# Altium schematic sheet Connectors.SchDoc: HR20E
size A3; Organization: Highlander Racing; Address1: UC Riverside
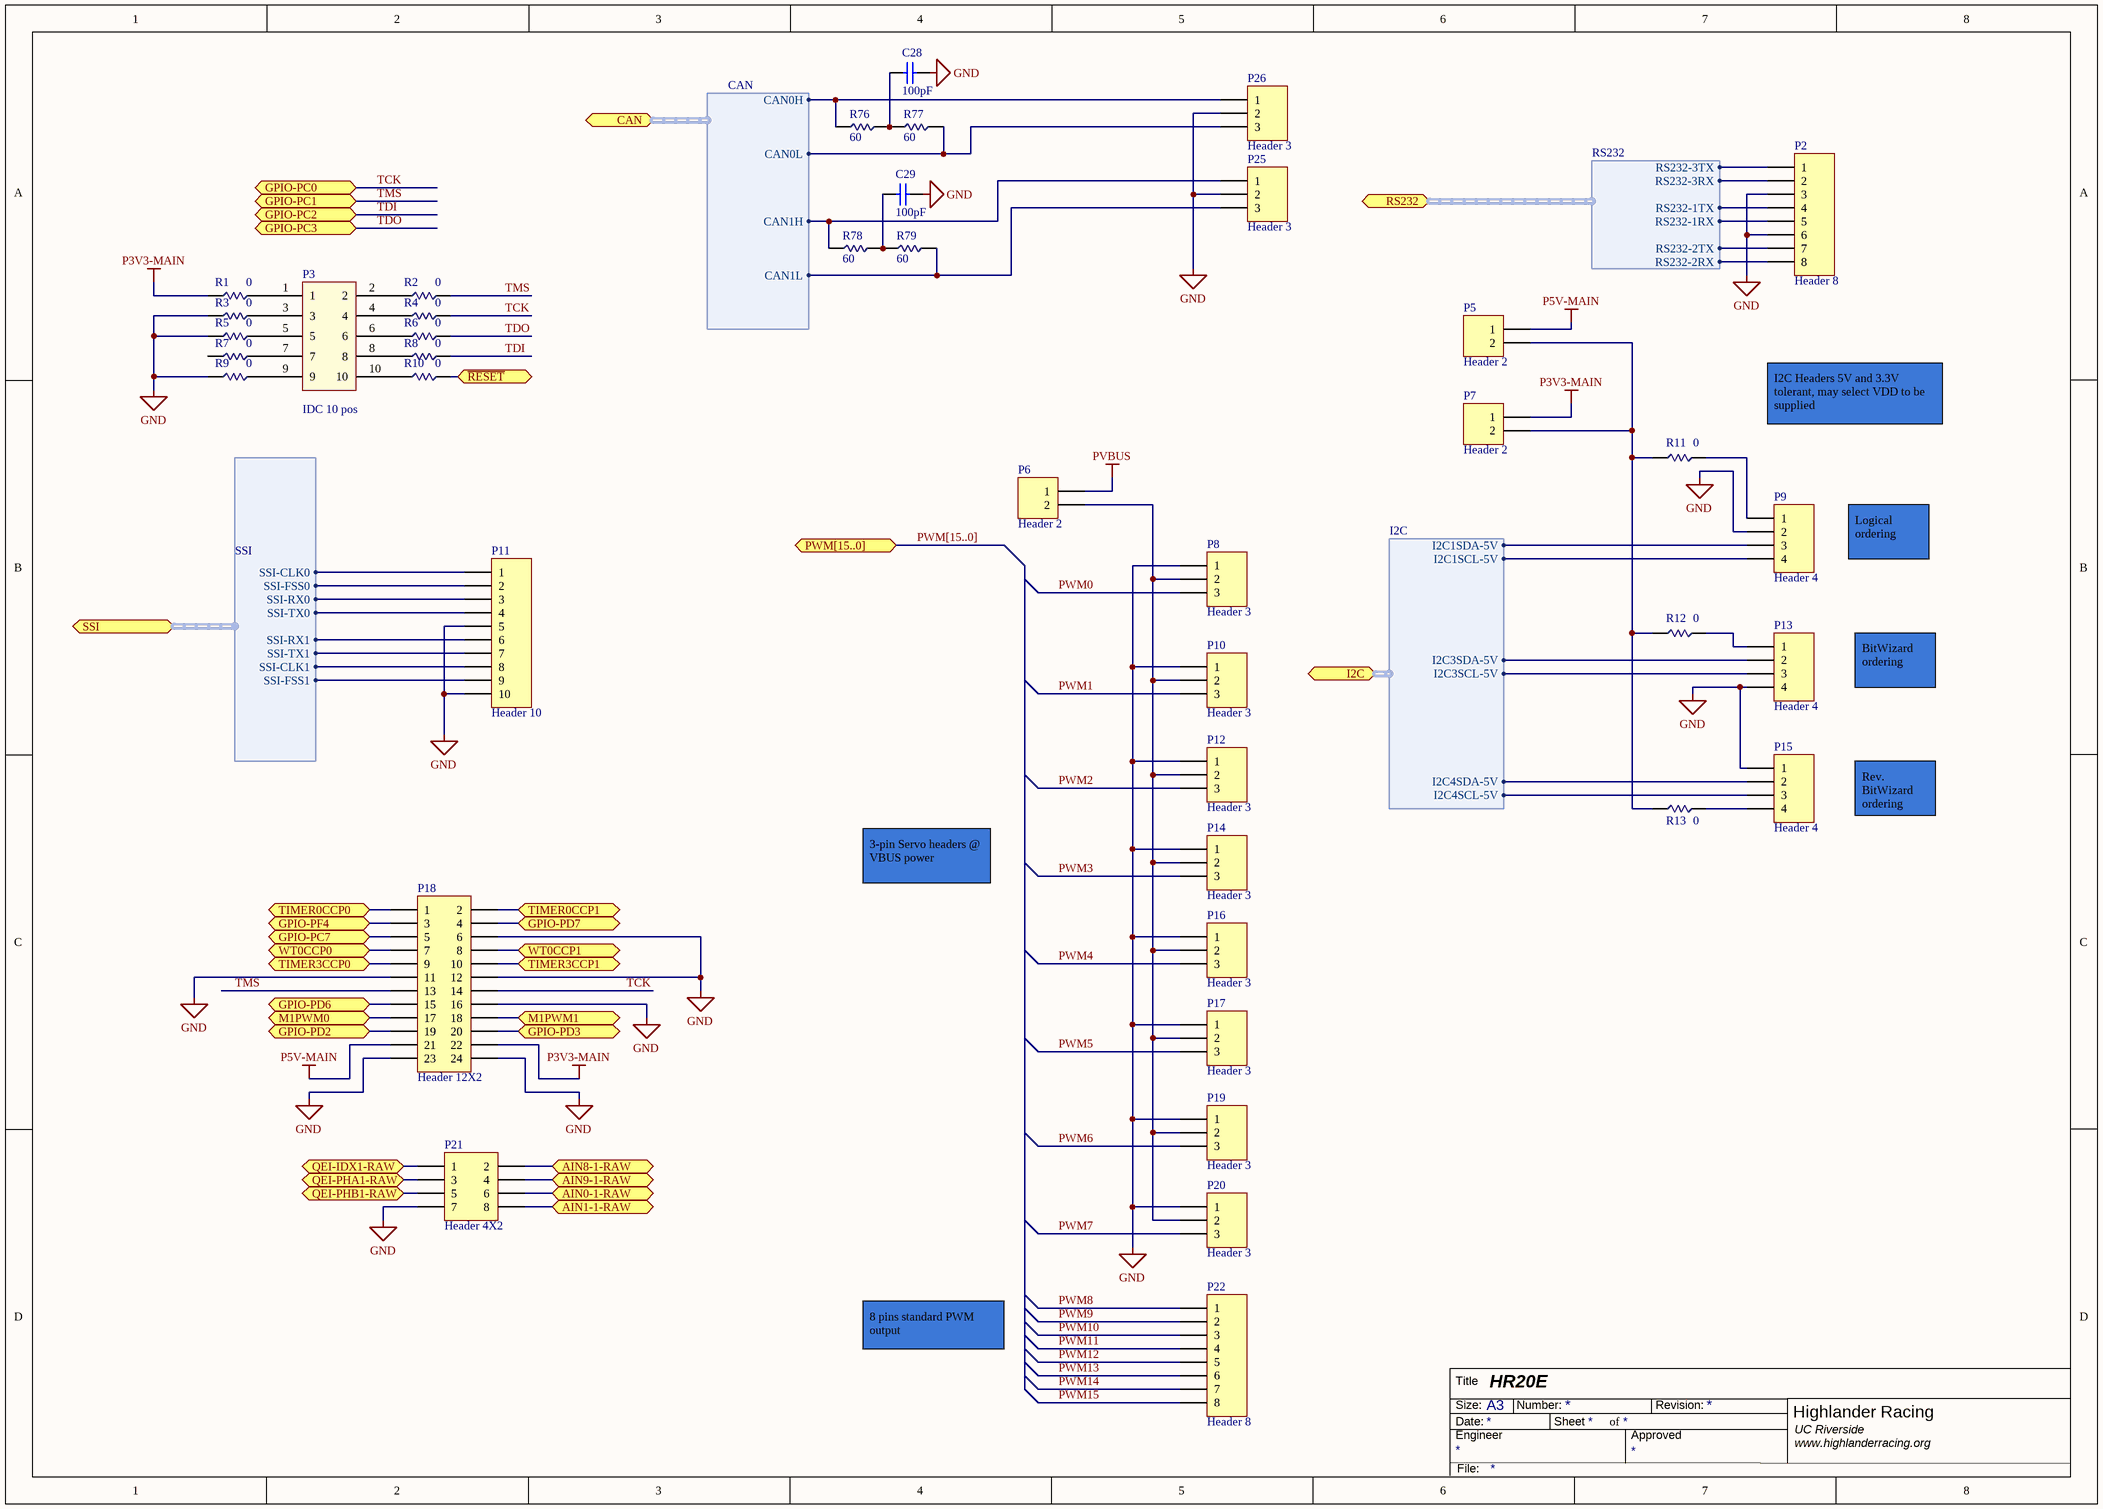
[diagram p0: Connectors.SchDoc]

## Parts
C28  value 100pF  [FOOTPRINT-0805-GEN]  (hidden comment: Capacitor-Generic-0805)
C29  value 100pF  [FOOTPRINT-0805-GEN]  (hidden comment: Capacitor-Generic-0805)
P2  Header 8  [HDR1X8]
P3  IDC 10 pos  [FOOTPRINT-GENERIC-10-HEADER-0MM5]
P5  Header 2  [HDR1X2]
P6  Header 2  [HDR1X2]
P7  Header 2  [HDR1X2]
P8  Header 3  [HDR1X3]
P9  Header 4  [HDR1X4]
P10  Header 3  [HDR1X3]
P11  Header 10  [HDR1X10]
P12  Header 3  [HDR1X3]
P13  Header 4  [HDR1X4]
P14  Header 3  [HDR1X3]
P15  Header 4  [HDR1X4]
P16  Header 3  [HDR1X3]
P17  Header 3  [HDR1X3]
P18  Header 12X2  [HDR2X12]
P19  Header 3  [HDR1X3]
P20  Header 3  [HDR1X3]
P21  Header 4X2  [HDR2X4]
P22  Header 8  [HDR1X8]
P25  Header 3  [HDR1X3]
P26  Header 3  [HDR1X3]
R1  value 0  [FOOTPRINT-0805-GEN]  (hidden comment: SMC)
R2  value 0  [FOOTPRINT-0805-GEN]  (hidden comment: SMC)
R3  value 0  [FOOTPRINT-0805-GEN]  (hidden comment: SMC)
R4  value 0  [FOOTPRINT-0805-GEN]  (hidden comment: SMC)
R5  value 0  [FOOTPRINT-0805-GEN]  (hidden comment: SMC)
R6  value 0  [FOOTPRINT-0805-GEN]  (hidden comment: SMC)
R7  value 0  [FOOTPRINT-0805-GEN]  (hidden comment: SMC)
R8  value 0  [FOOTPRINT-0805-GEN]  (hidden comment: SMC)
R9  value 0  [FOOTPRINT-0805-GEN]  (hidden comment: SMC)
R10  value 0  [FOOTPRINT-0805-GEN]  (hidden comment: SMC)
R11  value 0  [FOOTPRINT-0805-GEN]  (hidden comment: SMC)
R12  value 0  [FOOTPRINT-0805-GEN]  (hidden comment: SMC)
R13  value 0  [FOOTPRINT-0805-GEN]  (hidden comment: SMC)
R76  value 60  [FOOTPRINT-0805-GEN]  (hidden comment: SMC)
R77  value 60  [FOOTPRINT-0805-GEN]  (hidden comment: SMC)
R78  value 60  [FOOTPRINT-0805-GEN]  (hidden comment: SMC)
R79  value 60  [FOOTPRINT-0805-GEN]  (hidden comment: SMC)

## Ports
AIN0-1-RAW (bidir), AIN1-1-RAW (bidir), AIN8-1-RAW (bidir), AIN9-1-RAW (bidir), CAN (bidir, harness CAN), GPIO-PC0 (bidir), GPIO-PC1 (bidir), GPIO-PC2 (bidir), GPIO-PC3 (bidir), GPIO-PC7 (bidir), GPIO-PD2 (bidir), GPIO-PD3 (bidir), GPIO-PD6 (bidir), GPIO-PD7 (bidir), GPIO-PF4 (bidir), I2C (bidir, harness I2C), M1PWM0 (bidir), M1PWM1 (bidir), PWM[15..0] (bidir), QEI-IDX1-RAW (bidir), QEI-PHA1-RAW (bidir), QEI-PHB1-RAW (bidir), RS232 (bidir, harness RS232), SSI (bidir, harness SSI), TIMER0CCP0 (bidir), TIMER0CCP1 (bidir), TIMER3CCP0 (bidir), TIMER3CCP1 (bidir), WT0CCP0 (bidir), WT0CCP1 (bidir), ~{RESET} (bidir)

## Harnesses
SSI: SSI-TX1, SSI-CLK1, SSI-RX1, SSI-FSS1, SSI-CLK0, SSI-FSS0, SSI-RX0, SSI-TX0
CAN: CAN0H, CAN0L, CAN1H, CAN1L
I2C: I2C1SCL-5V, I2C1SDA-5V, I2C3SCL-5V, I2C3SDA-5V, I2C4SCL-5V, I2C4SDA-5V
RS232: RS232-1RX, RS232-1TX, RS232-2RX, RS232-2TX, RS232-3RX, RS232-3TX

## Nets
GND: C28.2 C29.2 P2.3 P2.6 P8.1 P9.2 P10.1 P11.5 P11.10 P12.1 P13.4 P14.1 P15.1 P16.1 P17.1 P18.6 P18.11 P18.12 P18.16 P18.23 P18.24 P19.1 P20.1 P21.7 P25.2 P26.2 R3.1 R5.1 R9.1
P3V3-MAIN: P7.1 P18.22 R1.1
P5V-MAIN: P5.1 P18.21
PVBUS: P6.1
~{RESET}: R10.2 ; port ~{RESET}
AIN0-1-RAW: P21.6 ; port AIN0-1-RAW
AIN1-1-RAW: P21.8 ; port AIN1-1-RAW
AIN8-1-RAW: P21.2 ; port AIN8-1-RAW
AIN9-1-RAW: P21.4 ; port AIN9-1-RAW
GPIO-PC7: P18.5 ; port GPIO-PC7
GPIO-PD2: P18.19 ; port GPIO-PD2
GPIO-PD3: P18.20 ; port GPIO-PD3
GPIO-PD6: P18.15 ; port GPIO-PD6
GPIO-PD7: P18.4 ; port GPIO-PD7
GPIO-PF4: P18.3 ; port GPIO-PF4
M1PWM0: P18.17 ; port M1PWM0
M1PWM1: P18.18 ; port M1PWM1
PWM0: P8.3
PWM1: P10.3
PWM2: P12.3
PWM3: P14.3
PWM4: P16.3
PWM5: P17.3
PWM6: P19.3
PWM7: P20.3
PWM8: P22.1
PWM9: P22.2
PWM10: P22.3
PWM11: P22.4
PWM12: P22.5
PWM13: P22.6
PWM14: P22.7
PWM15: P22.8
QEI-IDX1-RAW: P21.1 ; port QEI-IDX1-RAW
QEI-PHA1-RAW: P21.3 ; port QEI-PHA1-RAW
QEI-PHB1-RAW: P21.5 ; port QEI-PHB1-RAW
TCK: P18.14 R4.2 ; port GPIO-PC0
TDI: R8.2 ; port GPIO-PC2
TDO: R6.2 ; port GPIO-PC3
TIMER0CCP0: P18.1 ; port TIMER0CCP0
TIMER0CCP1: P18.2 ; port TIMER0CCP1
TIMER3CCP0: P18.9 ; port TIMER3CCP0
TIMER3CCP1: P18.10 ; port TIMER3CCP1
TMS: P18.13 R2.2 ; port GPIO-PC1
WT0CCP0: P18.7 ; port WT0CCP0
WT0CCP1: P18.8 ; port WT0CCP1
NetC28_1: C28.1 R76.1 R77.2
NetC29_1: C29.1 R78.1 R79.2
NetP2_1: P2.1 ; port RS232.RS232-3TX
NetP2_2: P2.2 ; port RS232.RS232-3RX
NetP2_4: P2.4 ; port RS232.RS232-1TX
NetP2_5: P2.5 ; port RS232.RS232-1RX
NetP2_7: P2.7 ; port RS232.RS232-2TX
NetP2_8: P2.8 ; port RS232.RS232-2RX
NetP3_1: P3.1 R1.2
NetP3_2: P3.2 R2.1
NetP3_3: P3.3 R3.2
NetP3_4: P3.4 R4.1
NetP3_5: P3.5 R5.2
NetP3_6: P3.6 R6.1
NetP3_7: P3.7 R7.2
NetP3_8: P3.8 R8.1
NetP3_9: P3.9 R9.2
NetP3_10: P3.10 R10.1
NetP5_2: P5.2 P7.2 R11.1 R12.1 R13.1
NetP6_2: P6.2 P8.2 P10.2 P12.2 P14.2 P16.2 P17.2 P19.2 P20.2
NetP9_1: P9.1 R11.2
NetP9_3: P9.3 ; port I2C.I2C1SDA-5V
NetP9_4: P9.4 ; port I2C.I2C1SCL-5V
NetP11_1: P11.1 ; port SSI.SSI-CLK0
NetP11_2: P11.2 ; port SSI.SSI-FSS0
NetP11_3: P11.3 ; port SSI.SSI-RX0
NetP11_4: P11.4 ; port SSI.SSI-TX0
NetP11_6: P11.6 ; port SSI.SSI-RX1
NetP11_7: P11.7 ; port SSI.SSI-TX1
NetP11_8: P11.8 ; port SSI.SSI-CLK1
NetP11_9: P11.9 ; port SSI.SSI-FSS1
NetP13_1: P13.1 R12.2
NetP13_2: P13.2 ; port I2C.I2C3SDA-5V
NetP13_3: P13.3 ; port I2C.I2C3SCL-5V
NetP15_2: P15.2 ; port I2C.I2C4SDA-5V
NetP15_3: P15.3 ; port I2C.I2C4SCL-5V
NetP15_4: P15.4 R13.2
NetP25_1: P25.1 R78.2 ; port CAN.CAN1H
NetP25_3: P25.3 R79.1 ; port CAN.CAN1L
NetP26_1: P26.1 R76.2 ; port CAN.CAN0H
NetP26_3: P26.3 R77.1 ; port CAN.CAN0L

Not connected (* = marked no-connect by the designer): R7 1

## Buses and harness runs
bus PWM[15..0] = port PWM[15..0]

## Notes on the sheet
- I2C Headers 5V and 3.3V tolerant, may select VDD to be supplied
- Logical ordering
- BitWizard ordering
- Rev. BitWizard ordering
- 3-pin Servo headers @ VBUS power
- 8 pins standard PWM output
- Title
- Size:
- Date:
- Engineer
- A3
- Number:
- Sheet
- of
- Approved
- Revision:
- UC Riverside
- www.highlanderracing.org <http://www.highlanderracing.org>
- File:

## Library data of the parts
C28 C29 = Capacitor-Generic-0805: Capacitor; Published: 8-Jun-2000; LatestRevisionDate: 17-Jul-2002; LatestRevisionNote: Re-released for DXP Platform.; PackageReference: RAD-0.3; Publisher: Altium Limited; PackageDescription: Radial Cap, Thru-Hole; 2 Leads; 0.3 in Pin Spacing
P2 P22 = Header 8: Header, 8-Pin; LatestRevisionDate: 17-Jul-2002; LatestRevisionNote: Re-released for DXP Platform.; Publisher: Altium Limited
P3 = Connector-Generic-Header-10-0mm5
P5-P7 = Header 2: Header, 2-Pin; LatestRevisionDate: 17-Jul-2002; LatestRevisionNote: Re-released for DXP Platform.; Publisher: Altium Limited
P8 P10 P12 P14 P16 P17 P19 P20 P25 P26 = Header 3: Header, 3-Pin; LatestRevisionDate: 17-Jul-2002; LatestRevisionNote: Re-released for DXP Platform.; Publisher: Altium Limited
P9 P13 P15 = Header 4: Header, 4-Pin; LatestRevisionDate: 17-Jul-2002; LatestRevisionNote: Re-released for DXP Platform.; Publisher: Altium Limited
P11 = Header 10: Header, 10-Pin; LatestRevisionDate: 17-Jul-2002; LatestRevisionNote: Re-released for DXP Platform.; Publisher: Altium Limited
P18 = Header 12X2: Header, 12-Pin, Dual row; LatestRevisionDate: 17-Jul-2002; LatestRevisionNote: Re-released for DXP Platform.; Publisher: Altium Limited
P21 = Header 4X2: Header, 4-Pin, Dual row; LatestRevisionDate: 17-Jul-2002; LatestRevisionNote: Re-released for DXP Platform.; Publisher: Altium Limited
R1-R13 R76-R79 = Resistor-Generic-0805-2012: 1/8 Watt Surface Mount Resistor